# EAGLE schematic ExploraRoverRobot_DistanceSensorSystem (EAGLE 9.3.0)
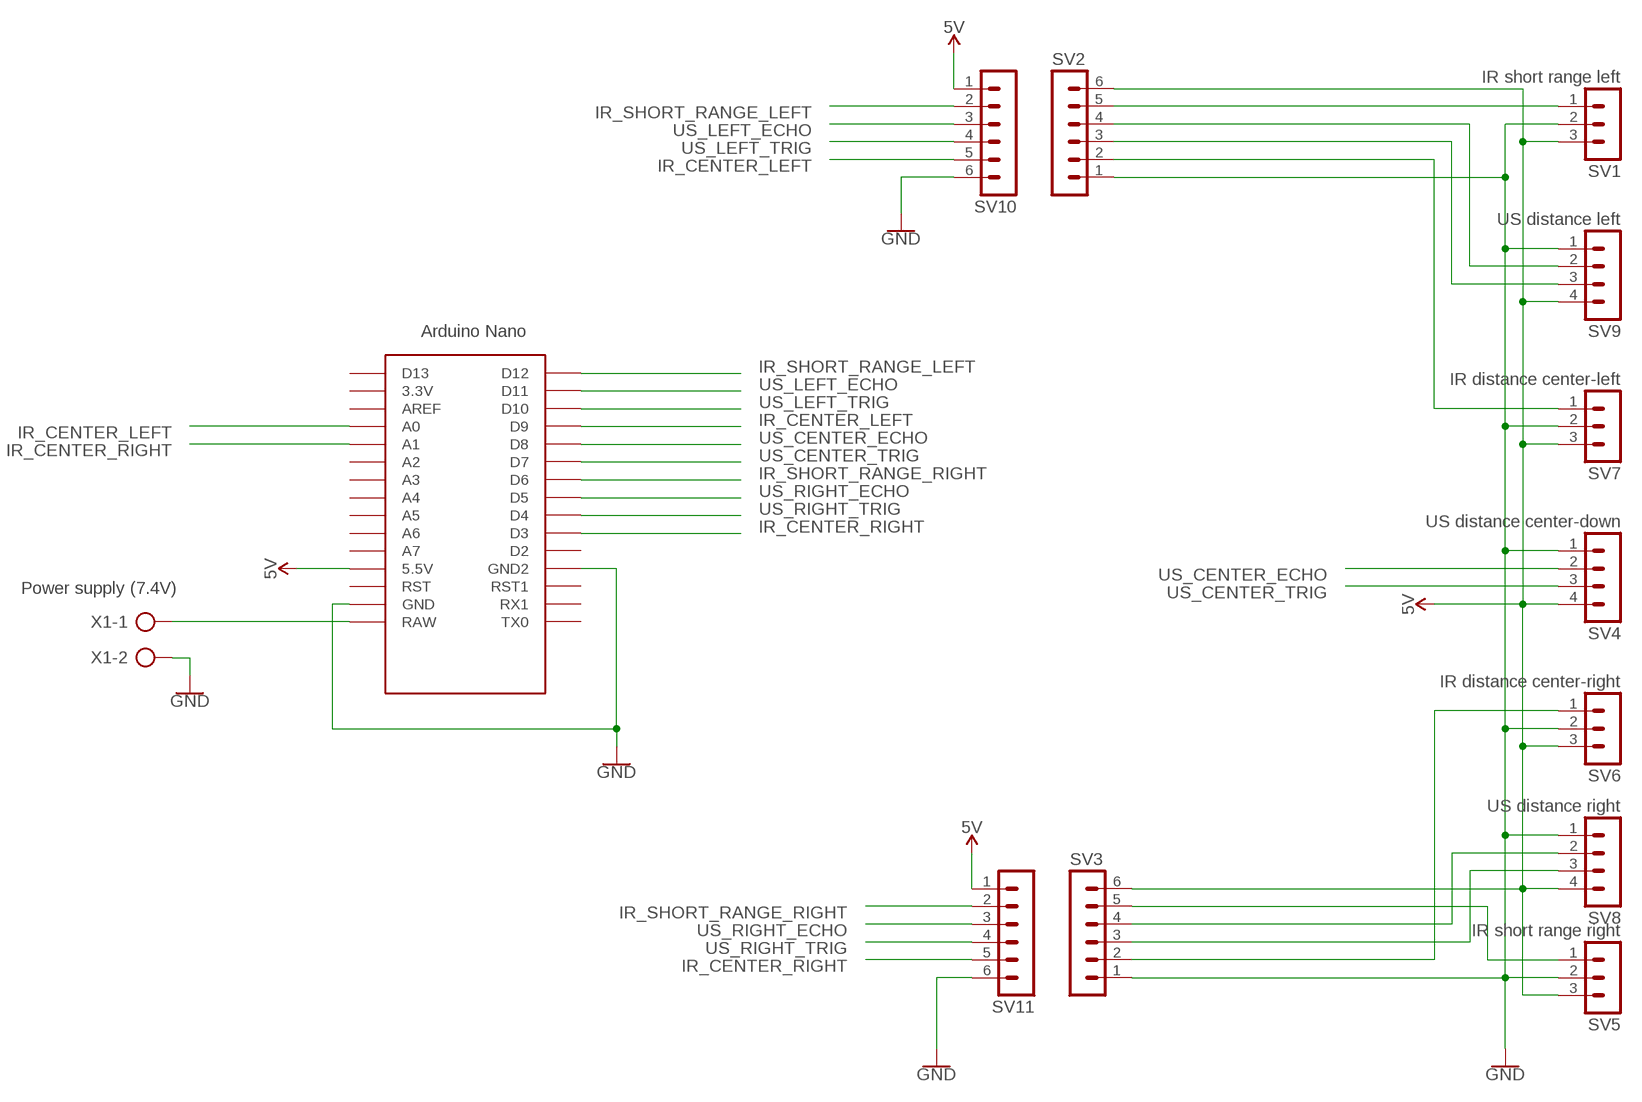
[diagram p0: schematic, sheet 1]

## Parts
SV1  IR short range left  MA03-1  [MA03-1]
SV2  MA06-1  [MA06-1]
SV3  MA06-1  [MA06-1]
SV4  US distance center-down  MA04-1  [MA04-1]
SV5  IR short range right  MA03-1  [MA03-1]
SV6  IR distance center-right  MA03-1  [MA03-1]
SV7  IR distance center-left  MA03-1  [MA03-1]
SV8  US distance right  MA04-1  [MA04-1]
SV9  US distance left  MA04-1  [MA04-1]
SV10  MA06-1  [MA06-1]
SV11  MA06-1  [MA06-1]
U$1  NANO  [NANO]
X1  Power supply (7.4V)  AK500/2  [AK500/2]

## Nets
5V: SV1.3 SV2.6 SV3.6 SV4.4 SV5.3 SV6.3 SV7.3 SV8.4 SV9.4 SV10.1 SV11.1 U$1.5V(5.5V)
GND: SV1.2 SV2.1 SV3.1 SV4.1 SV5.2 SV6.2 SV7.2 SV8.1 SV9.1 SV10.6 SV11.6 U$1.GND U$1.GND1(GND2) X1.2
IR_CENTER_LEFT: SV10.5 U$1.A0 U$1.D9
IR_CENTER_RIGHT: SV11.5 U$1.A1 U$1.D3
IR_SHORT_RANGE_LEFT: SV10.2 U$1.D12
IR_SHORT_RANGE_RIGHT: SV11.2 U$1.D6
N$1: SV1.1 SV2.5
N$2: U$1.RAW X1.1
N$3: SV2.4 SV9.2
N$4: SV2.3 SV9.3
N$5: SV2.2 SV7.1
N$6: SV3.5 SV5.1
N$7: SV3.4 SV8.2
N$8: SV3.3 SV8.3
N$9: SV3.2 SV6.1
US_CENTER_ECHO: SV4.2 U$1.D8
US_CENTER_TRIG: SV4.3 U$1.D7
US_LEFT_ECHO: SV10.3 U$1.D11
US_LEFT_TRIG: SV10.4 U$1.D10
US_RIGHT_ECHO: SV11.3 U$1.D5
US_RIGHT_TRIG: SV11.4 U$1.D4
Unconnected: U$1.3.3V U$1.A2 U$1.A3 U$1.A4 U$1.A5 U$1.A6 U$1.A7 U$1.AREF U$1.D2 U$1.D13 U$1.ICSP1 U$1.ICSP2 U$1.ICSP3 U$1.ICSP4 U$1.ICSP5 U$1.ICSP6 U$1.RST U$1.RST1 U$1.RX1 U$1.TX0

## Library data of the parts
SV1 SV5-SV7 = con-lstb:MA03-1: PIN HEADER; OC_FARNELL: unknown; OC_NEWARK: unknown
SV2 SV3 SV10 SV11 = con-lstb:MA06-1: PIN HEADER; OC_FARNELL: unknown; OC_NEWARK: unknown
SV4 SV8 SV9 = con-lstb:MA04-1: PIN HEADER; OC_FARNELL: unknown; OC_NEWARK: unknown
U$1 = Arduino-clone:NANO: Arduino Nano
X1 = con-ptr500:AK500/2: CONNECTOR; OC_FARNELL: unknown; OC_NEWARK: unknown